# EAGLE design heatingHeaderEQ3 (EAGLE 6.3)
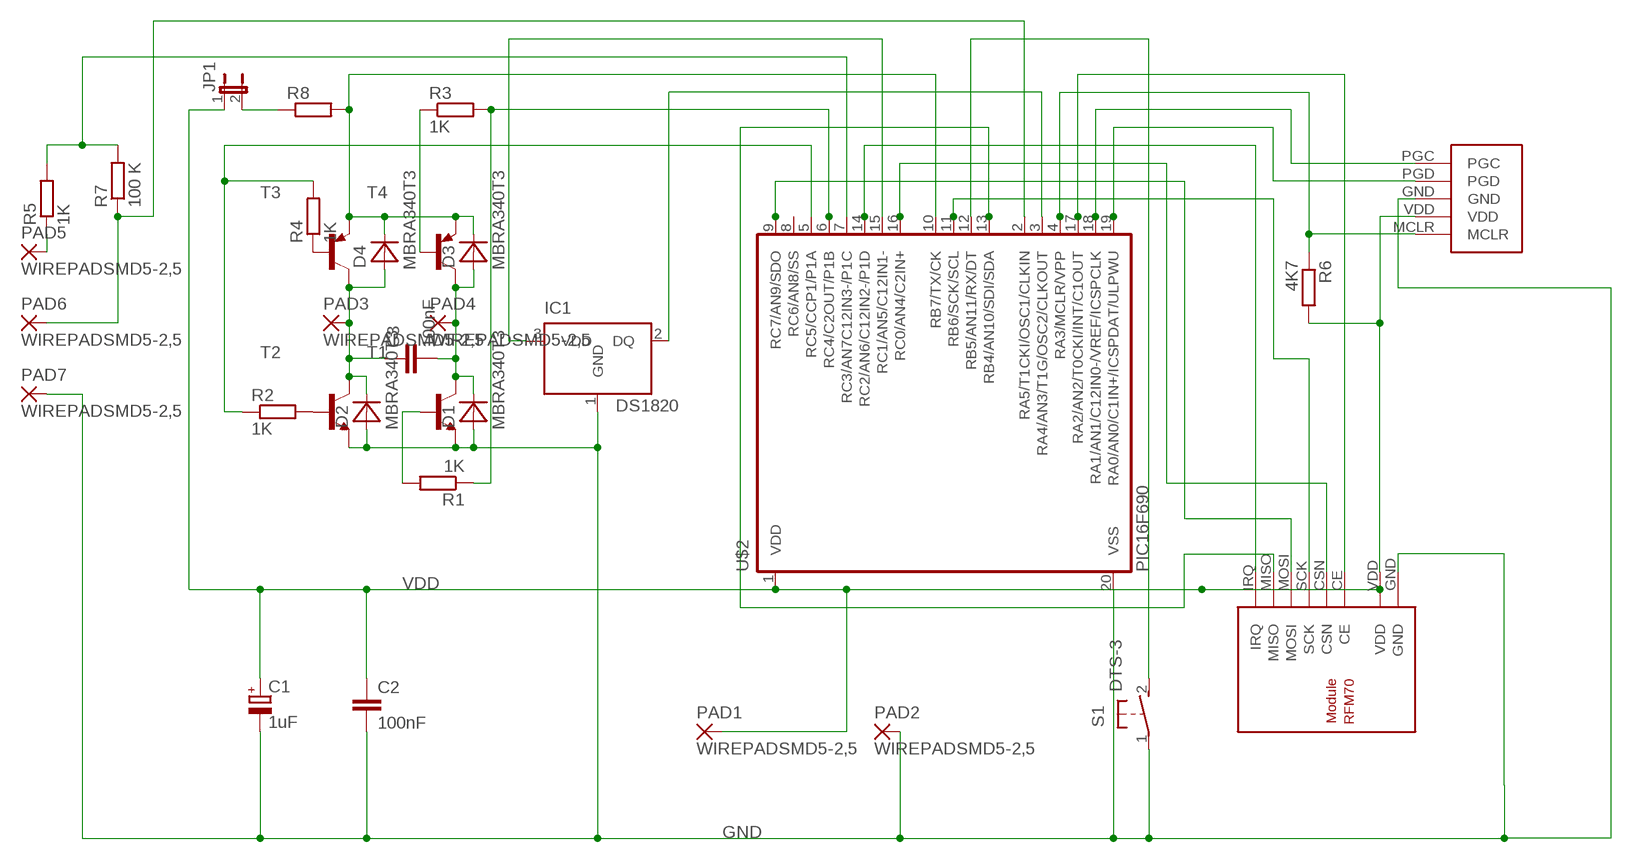
[diagram p0: schematic, sheet 1]

## Parts
C1  1uF  CPOL-EUSMCA  [SMC_A]
C2  100nF  C-EUC2012  [C2012]
C3  100nF  C-EUC2012  [C2012]
D1  MBRA340T3  [SMA]
D2  MBRA340T3  [SMA]
D3  MBRA340T3  [SMA]
D4  MBRA340T3  [SMA]
IC1  DS1820  [TO-92]
JP1  JP1E  [JP1]
PAD1  WIREPADSMD5-2,5  [5-2,5]
PAD2  WIREPADSMD5-2,5  [5-2,5]
PAD3  WIREPADSMD5-2,5  [5-2,5]
PAD4  WIREPADSMD5-2,5  [5-2,5]
PAD5  WIREPADSMD5-2,5  [5-2,5]
PAD6  WIREPADSMD5-2,5  [5-2,5]
PAD7  WIREPADSMD5-2,5  [5-2,5]
R1  1K  R-EU_R1206  [R1206]
R2  1K  R-EU_R1206  [R1206]
R3  1K  R-EU_R1206  [R1206]
R4  1K  R-EU_R1206  [R1206]
R5  1K  R-EU_R1206  [R1206]
R6  4K7  R-EU_R1206W  [R1206W]
R7  100 K  R-EU_R1206  [R1206]
R8  R-EU_R2512W  [R2512W]
S1  DTS-3  [DTS-3]
T1  BC817-40-NPN-SOT23-BEC  [SOT23-BEC]
T2  BC817-40-NPN-SOT23-BEC  [SOT23-BEC]
T3  BC807-16-PNP-SOT23-BEC  [SOT23-BEC]
T4  BC807-16-PNP-SOT23-BEC  [SOT23-BEC]
U$1  RFM70  [RFM70]
U$2  PIC16F690  [SSOP20]
U$3  PROGRAMMINGHEADERDIP  [PROGHEADER]

## Nets
GND: C1.- C2.2 D1.A D2.A IC1.1(GND) PAD2.1(P) PAD7.1(P) S1.1 T1.E T2.E U$1.GND U$2.20(VSS) U$3.GND
N$1: IC1.2(DQ) U$2.3(RA4/AN3/T1G/OSC2/CLKOUT)
N$2: JP1.2 R8.1
N$3: IC1.3(VDD) U$2.15(RC1/AN5/C12IN1-)
N$4: PAD5.1(P) R5.1
N$6: U$1.MISO U$2.13(RB4/AN10/SDI/SDA)
N$7: C3.1 D2.C D4.A PAD3.1(P) T2.C T3.C
N$8: C3.2 D1.C D3.A PAD4.1(P) T1.C T4.C
N$9: PAD6.1(P) R7.1 U$2.2(RA5/T1CKI/OSC1/CLKIN)
N$10: S1.2 U$2.12(RB5/AN11/RX/DT)
N$12: R5.2 R7.2 U$2.7(RC3/AN7C12IN3-/P1C)
N$13: R2.2 T2.B
N$14: R4.1 T3.B
N$15: D3.C D4.C R8.2 T3.E T4.E U$2.10(RB7/TX/CK)
N$16: U$1.CE U$2.17(RA2/AN2/T0CKI/INT/C1OUT)
N$18: U$2.19(RA0/AN0/C1IN+/ICSPDAT/ULPWU) U$3.PGD
N$19: U$2.18(RA1/AN1/C12IN0-/VREF/ICSPCLK) U$3.PGC
N$20: U$1.CSN U$2.16(RC0/AN4/C2IN+)
N$21: U$1.IRQ U$2.14(RC2/AN6/C12IN2-/P1D)
N$22: U$1.SCK U$2.11(RB6/SCK/SCL)
N$23: U$1.MOSI U$2.9(RC7/AN9/SDO)
N$24: R1.2 T1.B
N$25: R6.1 U$2.4(RA3/MCLR/VPP) U$3.MCLR
N$27: R3.1 T4.B
N$30: R1.1 R3.2 U$2.6(RC4/C2OUT/P1B)
N$31: R2.1 R4.2 U$2.5(RC5/CCP1/P1A)
VDD: C1.+ C2.1 JP1.1 PAD1.1(P) R6.2 U$1.VDD U$2.1(VDD) U$3.VDD
Unconnected: U$2.8(RC6/AN8/SS)

## Library data of the parts
C1 = resistor:CPOL-EU: POLARIZED CAPACITOR, European symbol
C2 C3 = resistor:C-EU: CAPACITOR, European symbol
D1-D4 = diode:MBRA340T3: Surface Mount Schottky Power Rectifier Source: http://www.onsemi.com/pub_link/Collateral/MBRA340T3-D.PDF
IC1 = ds1820:DS1820: DS1820 - 1-Wire Digital Thermometer
JP1 = jumper:JP1E: JUMPER
PAD1-PAD7 = wirepad:WIREPAD: Wire PAD connect wire on PCB
R1-R8 = resistor:R-EU_: RESISTOR, European symbol
S1 = switch-tact:DTS-3
T1 T2 = transistor:*-NPN-: NPN Transistror BF959 corrected 2008.03.06
T3 T4 = transistor:*-PNP-: PNP Transistror
U$1 = rfm70:RFM70: RFM70 2.4 Ghz Funkmodul Autor: Daniel Weber Website: http://projects.web4clans.com Email: daniel.weber@web4clans.com
U$2 = microchip:PIC16F690*: MICROCONTROLLER PIC16F690 18 I/O One 16-bit timer Two 8-bit timer Two comparators Precision internal oscillator-software selectable 8 MHz - 32 KHz SSP w/ I2C Compatible Address mask option EUSART LIN 2.0 Compatible ECCP+ w/ PWM Steering 12 A/D Channels ULPW Enhanced Low Power Timer 1 Timer 1 Gate Synch Latch 4k Program Flash memory 256 bytes SRAM 256 bytes EEPROM
U$3 = rfm70:PROGRAMMINGHEADER

## Board
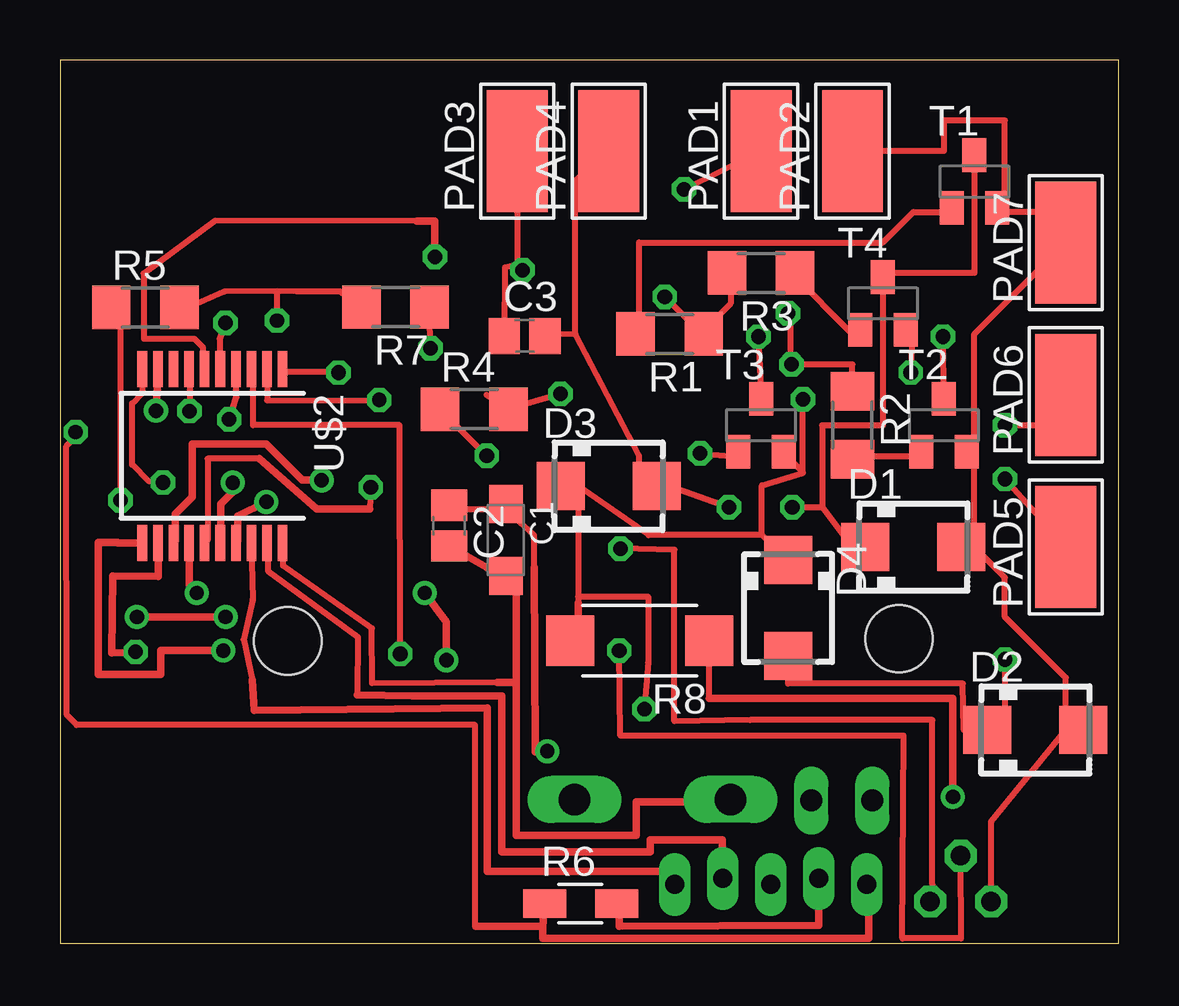
[diagram p1: board, top side]
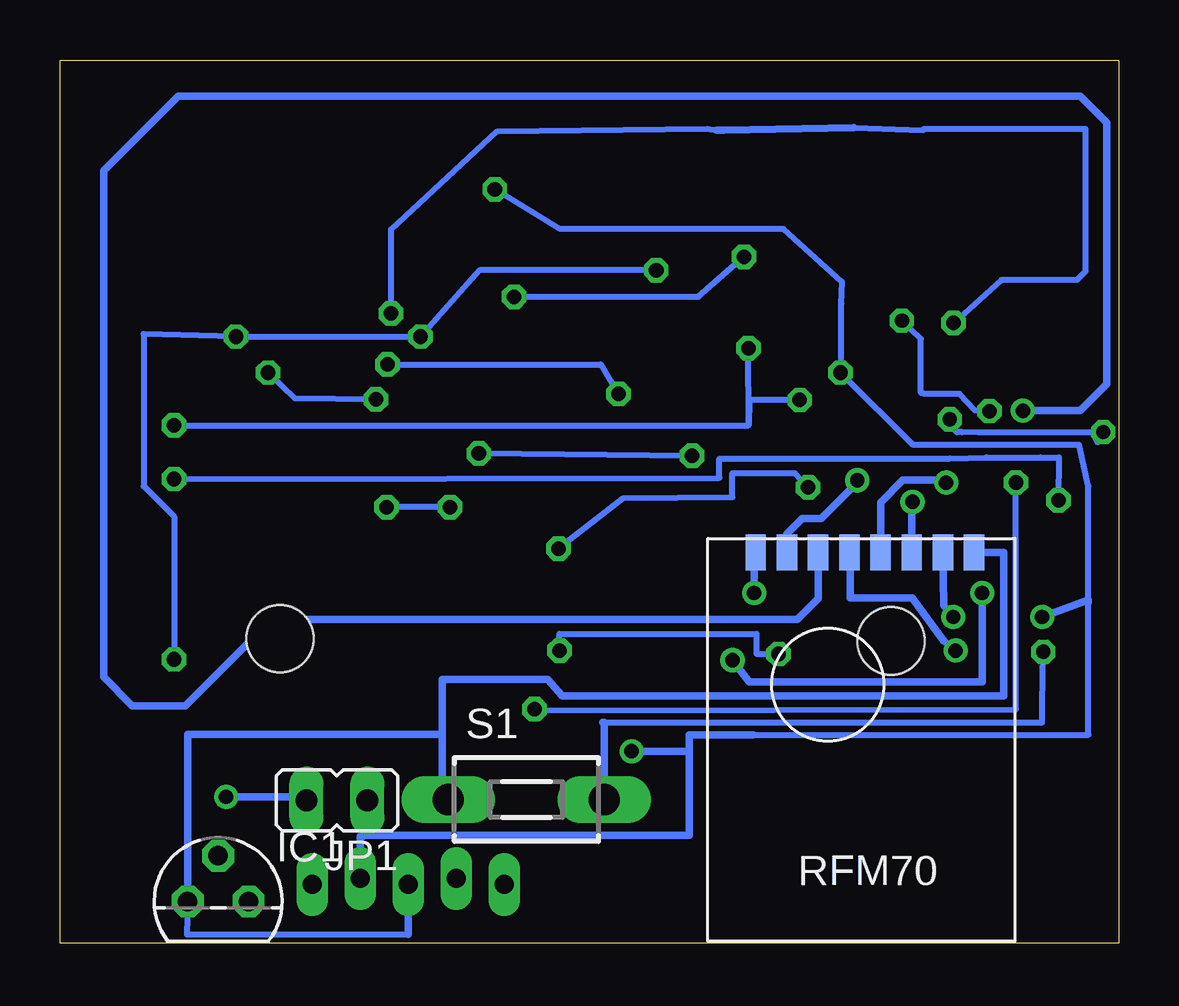
[diagram p2: board, bottom side, seen from below]

Size 44.12 x 36.82 mm. Coordinates in mm from the lower left corner, seen from the top.
Outline: 0,0 44.12,0 44.12,36.82 0,36.82 0,0
Copper layers (1*16): Top 0.035mm / dielectric 1.5mm / Bottom 0.035mm
Design rules "default": minimum track width 10mil, minimum drill 24mil, track to track 8mil, track to pad 8mil, pad to pad 8mil, via to via 8mil, smd to smd 8mil, copper to edge 40mil, drill to drill 8mil, minimum pad ring 10mil, minimum via ring 8mil, stop-mask expansion 4mil, vias tented up to drill 0mil, thermal gap 10mil
Holes 2.8 mm at 9.49,12.6 34.96,12.7

### Footprints (pad centres in the part's own frame; a part is rotated, then mirrored left to right if it is on the bottom)
SMC_A = smd 1.6 x 1.4: + -1.5,0; - 1.5,0
C2012 = smd 1.3 x 1.5: 1 -0.85,0; 2 0.85,0
SMA = smd 2 x 2: A 2,0; C -2,0
TO-92 = drill 0.813 pad 1.27 octagon: 1 -1.27,0; 2 0,1.905; 3 1.27,0
JP1 = drill 0.914 long: 1 0,-1.27; 2 0,1.27
5-2,5 = smd 2.54 x 5.08: 1 0,0
R1206 = smd 1.6 x 1.803: 1 -1.422,0; 2 1.422,0
R1206W = smd 1.8 x 1.2: 1 -1.499,0; 2 1.499,0
R2512W = smd 2 x 2.1: 1 -2.896,0; 2 2.896,0
DTS-3 = drill 1.3 long: 1 -3.25,0; 2 3.25,0
SOT23-BEC = smd 1 x 1.4: B -0.95,-1.1; C 0,1.1; E 0.95,-1.1
RFM70 = smd 0.85 x 1.5: CE 2.5,-14.3; CSN 3.8,-14.3; GND -0.1,-14.3; IRQ 9,-14.3; MISO 7.7,-14.3; MOSI 6.4,-14.3; SCK 5.1,-14.3; VDD 1.2,-14.3
SSOP20 = smd 0.4 x 1.5: 1 -2.925,-3.625; 2 -2.275,-3.625; 3 -1.625,-3.625; 4 -0.975,-3.625; 5 -0.325,-3.625; 6 0.325,-3.625; 7 0.975,-3.625; 8 1.625,-3.625; 9 2.275,-3.625; 10 2.925,-3.625; 11 2.925,3.625; 12 2.275,3.625; 13 1.625,3.625; 14 0.975,3.625; 15 0.325,3.625; 16 -0.325,3.625; 17 -0.975,3.625; 18 -1.625,3.625; 19 -2.275,3.625; 20 -2.925,3.625
PROGHEADER = drill 0.8 long: GND 0,0; MCLR -4,0; PGC 4,0; PGD 2,0.25; VDD -2,0.25

### Placement (x,y rotation side)
C1  18.58,16.81 270 top
C2  16.21,17.41 270 top
C3  19.36,25.32 0 top
D1  35.56,16.51 0 top
D2  40.64,8.89 0 top
D3  22.86,19.05 0 top
D4  30.34,13.97 270 top
IC1  37.53,1.74 0 bottom
JP1  32.58,5.95 90 bottom
PAD1  29.21,33.02 0 top
PAD2  33.02,33.02 0 top
PAD3  19.05,33.02 0 top
PAD4  22.86,33.02 0 top
PAD5  41.91,16.51 0 top
PAD6  41.91,22.86 0 top
PAD7  41.91,29.21 0 top
R1  25.4,25.4 180 top
R2  33.02,21.59 270 top
R3  29.21,27.94 180 top
R4  17.26,22.26 0 top
R5  3.56,26.5 0 top
R6  21.69,1.65 0 top
R7  13.98,26.52 180 top
R8  24.16,12.61 180 top
S1  24.69,5.99 0 bottom
T1  38.1,31.75 0 top
T2  36.83,21.59 0 top
T3  29.21,21.59 0 top
T4  34.29,26.67 0 top
U$1  6.13,1.98 180 bottom
U$2  6.35,20.32 180 top
U$3  29.61,2.45 0 bottom

### Tracks (layer width: path | path; a pad name or v marks a point on that pad's centre or on a via)
GND
  Top 0.254: 18.81,14.97 C1.- | 18.21,10.87 13.01,10.84 12.99,13.13 9.29,15.73 U$2.20 | 39.37,30.48 41.91,30.48 PAD7.1 38.1,25.4 38.1,20.32 | PAD2.1 36.83,33.02 36.83,34.29 39.37,34.29 39.37,30.48 | 39.37,30.48 T1.E | 38.1,16.51 38.1,20.32 | 41.91,8.89 38.8,5.08 IC1.1 | 38.1,16.51 39.37,15.24 39.37,13.6 41.91,11.06 41.91,8.89 | 38.1,16.51 D1.A | 41.91,8.89 D2.A | 38.1,20.32 T2.E
  Top 0.305: 18.81,14.97 19,14.77 19,10.87 | 19,10.87 19,4.5 24,4.5 24,5.9 27.74,5.9 S1.1 | C2.2 17.78,15.66 C1.- | 18.21,10.87 19,10.87
  Bottom 0.254: 29.61,0.37 38.83,0.37 IC1.1
  Bottom 0.305: S1.1 28.2,5.99 28.2,8.7 | 28.2,8.7 38.8,8.7 IC1.1 | U$3.GND 29.61,2.15 29.61,0.37 | U$1.GND 4.8,16.28 4.8,10.3 23.2,10.3 23.8,11 28.2,11 28.2,8.7
N$1  (via drill 0.61)
  Top 0.254: v14.18,12.06 14.15,21.6 8.05,21.6 8.05,23.8 U$2.3 | v23.3,12.2 23.35,8.65 35.15,8.65 35.1,0.2 37.55,0.2 IC1.2
  Bottom 0.254: v14.18,12.06 15.1,12.06 15.1,12.9 23.3,12.9 23.4,12.1 v23.3,12.2
N$2  (via drill 0.6)
  Top 0.254: 27.05,10.21 R8.1
  Top 0.305: 27.05,10.21 37.2,10.21 v37.2,6.1
  Bottom 0.305: v37.2,6.1 33.85,6.1 JP1.2
N$3  (via drill 0.61)
  Top 0.254: v12.95,19 12.9,18.1 | 8.3,20.2 6.15,20.2 6.15,16.8 U$2.15 | v23.35,16.45 25.6,16.4 25.6,9.25 28.75,9.3 36.35,9.3 36.35,2.45 IC1.3
  Top 0.305: 12.9,18.1 10.7,18.1 8.3,20.2
  Bottom 0.254: v12.95,19 13.5,19.6 16.1,19.6 16.1,18.6 20.65,18.55 v23.35,16.45
N$4  (via drill 0.61)
  Top 0.254: v2.52,18.46 2.54,26.52 R5.1 | PAD5.1 v39.37,19.35
  Bottom 0.254: v39.37,19.35 16.65,19.4 16.65,20.2 7.04,20.21 5.51,20.26 3.26,20.26 2.5,20.25 v2.52,18.46
N$6  (via drill 0.6)
  Top 0.305: v10.9,19.3 10.1,19.3 8.6,20.8 5.5,20.8 5.5,18.6 4.8,17.9 4.8,16.77 U$2.13
  Bottom 0.305: U$1.MISO 13.83,17.07 13.2,17.7 12.4,17.7 10.9,19.2 v10.9,19.3
N$7  (via drill 0.61)
  Top 0.254: D4.A 30.34,10.83 37.62,10.83 37.66,8.89 D2.C 39.37,8.89 v39.37,11.83 | v29.1,25.29 T3.C | T2.C v36.79,25.29 | 19.06,28.27 19.05,30.48 PAD3.1 | 19.06,28.27 18.54,28.17 C3.1 | 19.06,28.27 v19.28,28.05
  Bottom 0.254: v19.28,28.05 26.63,28.05 v29.1,25.29 v36.79,25.29 40.64,25.4 40.64,19.05 39.37,17.78 v39.37,11.83
N$8  (via drill 0.61)
  Top 0.254: 38.1,33.02 T1.C 38.1,27.94 34.29,27.94 T4.C 34.29,21.59 31.75,21.59 31.75,18.18 | 31.75,18.18 33.02,16.51 D1.C | 21.48,25.39 24.13,20.32 24.13,19.05 D3.A 25.4,19.05 v27.87,18.18 | 21.48,25.39 20.19,25.36 C3.2 | PAD4.1 21.48,31.79 21.48,25.39 | v30.51,18.18 31.75,18.18
  Bottom 0.254: v27.87,18.18 v30.51,18.18
N$9  (via drill 0.6, 0.61)
  Top 0.254: v15.44,24.8 15.4,25.77 R7.1 | v39.37,21.59 41.91,21.59 PAD6.1 | U$2.2 8.62,22.62 v13.3,22.65
  Bottom 0.254: 15.43,21.59 v15.44,24.8 | v39.37,21.59 15.43,21.59 | v13.3,22.65 15.4,22.65 15.43,21.59
N$10  (via drill 0.6)
  Top 0.305: U$2.12 4.1,15.29 2.2,15.3 2.15,12.1 v3.15,12.15
  Bottom 0.254: 21.44,9.2 3.2,9.2 3.2,9.95 v3.15,12.15
  Bottom 0.305: 21.5,9.2 21.44,9.2 S1.2
N$12  (via drill 0.6)
  Top 0.254: 9.06,27.18 9.86,27.16 11.68,27.16 R7.2 | 9.06,27.18 6.82,27.16 5.1,26.4 4.98,26.52 R5.2 5.08,26.67 | U$2.7 5.41,22.91 v5.39,22.18 | v9.04,25.95 9.05,26.38 9.06,27.18
  Bottom 0.254: v5.39,22.18 6,22.21 6.65,22.9 8.1,22.9 8.25,22.95 8.25,25.2 v9.04,25.95
N$13
  Top 0.254: T2.B 35.56,20.32 33.02,20.32 R2.2
N$14  (via drill 0.61)
  Top 0.254: v26.67,20.42 27.94,20.32 T3.B | v17.78,20.32 15.24,22.86 R4.1
  Bottom 0.254: v17.78,20.32 v26.67,20.42
N$15  (via drill 0.61)
  Top 0.254: 30.96,19.61 29.24,19.09 29.24,17.01 | v35.45,23.79 35.56,25.4 T4.E | 30.96,19.61 v30.96,22.67 | 30.96,19.61 T3.E | 21.59,19.05 24.53,17.01 29.24,17.01 | 29.24,17.01 D4.C | 21.59,19.05 21.59,14.45 | 21.59,14.45 21.59,14.18 | 21.59,19.05 D3.C | v4.29,19.21 3.7,19.25 3,19.95 3,22.5 3.45,22.95 3.45,23.8 3.5,23.8 U$2.10 | 21.59,14.45 24.5,14.45 24.5,11.7 v24.35,9.75
  Top 0.305: 21.59,14.18 21.56,12.58 R8.2
  Bottom 0.254: v35.45,23.79 34.33,22.71 v30.96,22.67 | v4.29,19.21 4.29,9.75 24.4,9.7 24.4,9.75 v24.35,9.75
N$16  (via drill 0.6)
  Top 0.305: v8.6,18.4 7.4,17.8 7.4,16.77 U$2.17
  Bottom 0.305: U$1.CE 8.63,18.17 v8.6,18.4
N$18
  Top 0.254: U$2.19 8.66,15.52 12.41,12.77 12.38,10.34
  Top 0.305: U$3.PGD 27.6,4.3 24.6,4.3 24.6,3.8 18.4,3.8 18.4,10.3 14.69,10.3 12.38,10.34
N$19
  Top 0.254: U$2.18 8.03,14.33 7.65,12.65 8,10.98
  Top 0.305: 8,10.98 8.1,9.7 17.8,9.8 17.8,3 25.61,3 U$3.PGC
N$20  (via drill 0.6)
  Top 0.305: v7.2,19.2 7.2,18.8 6.7,18.3 6.7,16.72 U$2.16
  Bottom 0.305: U$1.CSN 9.93,18.37 9,19.3 7.3,19.3 v7.2,19.2
N$21  (via drill 0.6)
  Top 0.305: U$2.14 5.38,14.93 v5.7,14.6 | v16.1,11.8 16.1,13.4 v15.2,14.6
  Bottom 0.305: v5.7,14.6 5.7,10.9 15.4,10.9 v16.1,11.8 | v15.2,14.6 15.2,16.21 U$1.IRQ
N$22  (via drill 0.6)
  Top 0.305: U$2.11 2.4,16.7 1.6,16.7 1.6,11.2 4.2,11.2 4.2,12.2 v6.8,12.2
  Bottom 0.305: v6.8,12.2 7.3,12.6 8.6,14.4 11.2,14.4 11.2,16.25 U$1.SCK
N$23  (via drill 0.6)
  Top 0.305: v4,22.2 4.1,23.87 U$2.9
  Bottom 0.305: U$1.MOSI 12.53,14.37 13.4,13.5 35.3,13.5 38.9,9.9 41.1,9.9 42.3,11.1 42.3,32.2 39.2,35.3 1.6,35.3 0.5,34.2 0.5,23.3 1.6,22.2 v4,22.2
N$24
  Top 0.254: T1.B 36.83,30.48 35.56,30.48 34.29,29.21 24.13,29.21 24.13,25.4 R1.2
N$25  (via drill 0.6)
  Top 0.254: 17.32,0.71 17.3,0.7 17.3,9.1 0.7,9.1 0.28,9.51 0.27,20.72 0.53,21 0.7,21 v0.65,21.31 | v7.05,21.84 7.35,22.75 7.35,23.92 U$2.4
  Top 0.305: R6.1 20.11,0.71 | 20.11,0.71 17.32,0.71 | U$3.MCLR 33.7,2.45 33.7,0.2 20.11,0.2 20.11,0.71
  Bottom 0.254: v0.65,21.31 0.89,20.88 1.12,21.29 5.87,21.29 6.54,21.3 6.75,21.3 7,21.55 v7.05,21.84
N$27
  Top 0.254: T4.B 33.02,25.4 30.48,27.94 R3.1
N$30  (via drill 0.61)
  Top 0.254: R3.2 27.94,27.94 27.94,26.67 26.67,25.4 R1.1 26.6,25.55 v25.2,26.95 | 14.86,30.1 6.46,30.12 3.49,27.92 3.49,25.2 5.6,25.2 5.95,24.85 5.95,24.15 U$2.6
  Top 0.305: 14.86,30.1 15.62,30.1 v15.62,28.61
  Bottom 0.254: v15.62,28.61 17.52,26.95 v25.2,26.95
N$31  (via drill 0.61)
  Top 0.254: v20.85,22.9 R4.2 17.78,22.86 | 33.02,22.86 R2.1 33.02,24.13 v30.48,24.13 30.45,24.15 30.45,25.9 v30.33,26.25 | v6.89,25.85 6.65,25.2 6.65,24.15 U$2.5
  Bottom 0.254: v20.85,22.9 21.59,24.13 v30.48,24.13 | v6.89,25.85 4.9,27.65 1.75,27.65 1.4,28 1.4,33.95 8.13,33.95 8.14,33.9 11.04,33.99 | 16.76,33.9 17.15,33.95 25.9,33.85 30.33,29.75 v30.33,26.25
  Bottom 0.305: 11.04,33.99 16.46,33.9 16.76,33.9
VDD  (via drill 0.6, 0.61)
  Top 0.254: 18.58,18.08 16.65,18.08 C2.1 | 18.58,18.08 19.75,17.01 19.75,15.67 | 18.58,18.08 C1.+ | v26,31.43 PAD1.1 | v11.6,23.79 11.55,23.8 9.45,23.8 U$2.1
  Top 0.305: R6.2 23.3,1.65 23.3,0.7 31.61,0.75 U$3.VDD | 19.75,15.67 19.8,7.97 v20.3,8 | v6.9,13.6 v3.2,13.6 3.1,13.6
  Bottom 0.254: 11.56,23.75 8.56,20.77 6.84,20.77 5.11,20.78 1.66,20.77 1.27,19.05 1.27,14.2 1.27,8.69 15.24,8.69 | 11.56,23.75 11.56,26.67 11.53,27.57 13.97,29.78 23.29,29.78 v26,31.43 | 31.5,4.45 31.3,4.5 JP1.1 | v11.6,23.79 11.56,23.75
  Bottom 0.305: 15.24,8.69 17.9,8.69 17.9,8 | 17.9,8 17.9,4.5 31.3,4.5 31.31,4.5 JP1.1 | 31.5,4.45 31.61,4.45 U$3.VDD | v20.3,8 17.9,8 | U$1.VDD 7.3,14.08 v6.9,13.6 | v3.2,13.6 1.27,14.3 1.27,14.2